# EAGLE design vca (EAGLE 6.5.0)

## Sheet 1 of 2
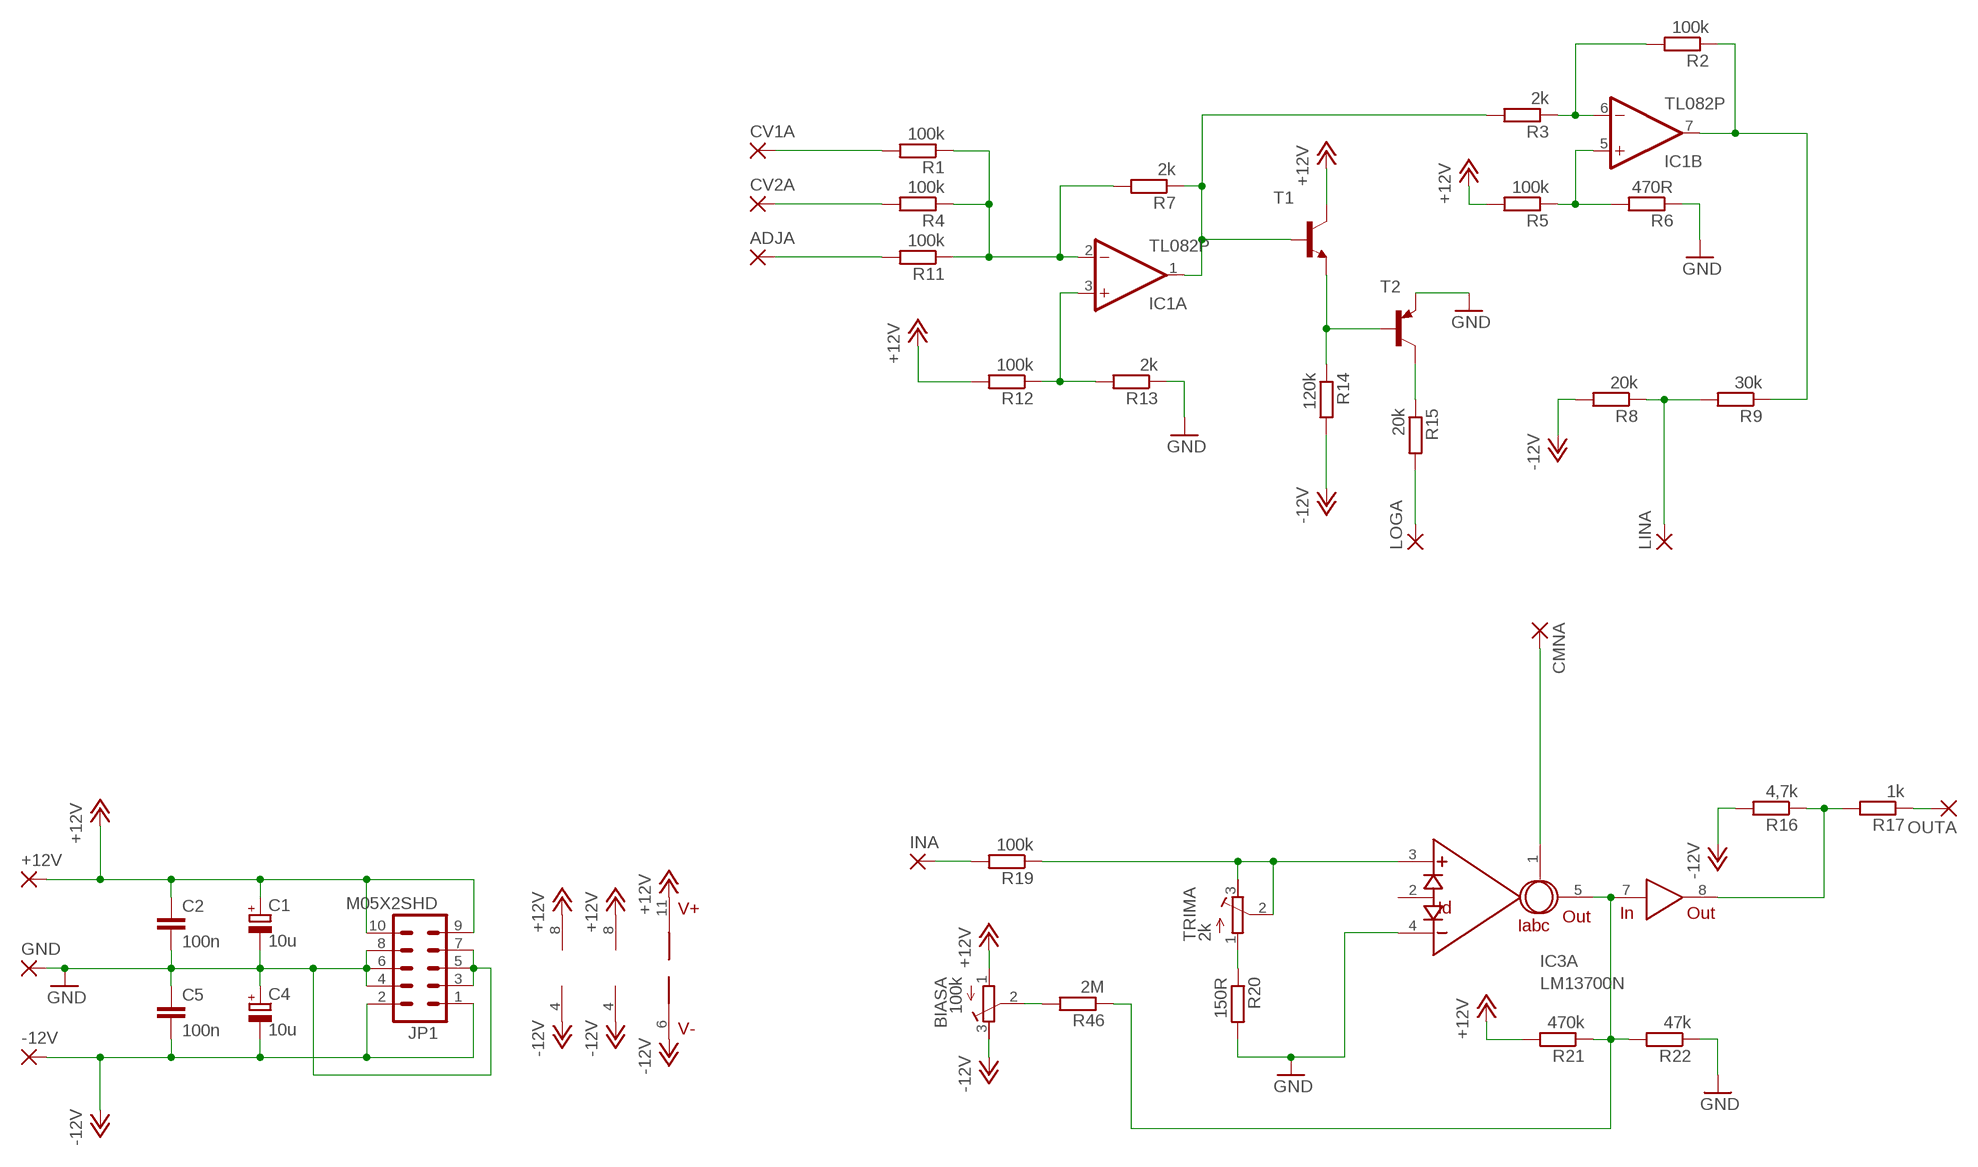
[diagram p0: schematic, sheet 1]

### Parts
+12V  2,54/1,0  [2,54/1,0]
-12V  2,54/1,0  [2,54/1,0]
ADJA  2,54/1,0  [2,54/1,0]
BIASA  100k  R-TRIMM64W  [RTRIM64W]
C1  10u  CPOL-EUE3.5-8  [E3,5-8]
C2  100n  C-EU050-035X075  [C050-035X075]
C4  10u  CPOL-EUE3.5-8  [E3,5-8]
C5  100n  C-EU050-035X075  [C050-035X075]
CMNA  2,54/1,0  [2,54/1,0]
CV1A  2,54/1,0  [2,54/1,0]
CV2A  2,54/1,0  [2,54/1,0]
GND  2,54/1,0  [2,54/1,0]
IC1  TL082P  [DIL08]
IC2  TL082P  [DIL08]
IC3  LM13700N  [DIL16]
INA  2,54/1,0  [2,54/1,0]
JP1  M05X2SHD  [2X5-SHROUDED]
LINA  2,54/1,0  [2,54/1,0]
LOGA  2,54/1,0  [2,54/1,0]
OUTA  2,54/1,0  [2,54/1,0]
R1  100k  R-EU_0309/V  [0309V]
R2  100k  R-EU_0309/10  [0309/10]
R3  2k  R-EU_0309/10  [0309/10]
R4  100k  R-EU_0309/V  [0309V]
R5  100k  R-EU_0309/10  [0309/10]
R6  470R  R-EU_0309/10  [0309/10]
R7  2k  R-EU_0309/V  [0309V]
R8  20k  R-EU_0309/10  [0309/10]
R9  30k  R-EU_0309/V  [0309V]
R11  100k  R-EU_0309/V  [0309V]
R12  100k  R-EU_0309/10  [0309/10]
R13  2k  R-EU_0309/10  [0309/10]
R14  120k  R-EU_0309/10  [0309/10]
R15  20k  R-EU_0309/V  [0309V]
R16  4,7k  R-EU_0309/10  [0309/10]
R17  1k  R-EU_0309/10  [0309/10]
R19  100k  R-EU_0309/10  [0309/10]
R20  150R  R-EU_0309/10  [0309/10]
R21  470k  R-EU_0309/10  [0309/10]
R22  47k  R-EU_0309/10  [0309/10]
R46  2M  R-EU_0309/10  [0309/10]
T1  2N3904-NPN-TO92-EBC  [TO92-EBC]
T2  2N3906-PNP-TO92-EBC  [TO92-EBC]
TRIMA  2k  R-TRIMM64W  [RTRIM64W]

### Nets
+12V: +12V.1(P) BIASA.1(A) C1.+ C2.1 IC1.8(P:V+) IC2.8(P:V+) IC3.11(V+) JP1.9 JP1.10 R5.2 R12.2 R21.2 T1.C ; also sheet 2
-12V: -12V.1(P) BIASA.3(E) C4.- C5.2 IC1.4(P:V-) IC2.4(P:V-) IC3.6(V-) JP1.1 JP1.2 R8.2 R14.2 R16.2 ; also sheet 2
GND: C1.- C2.2 C4.+ C5.1 GND.1(P) IC3.4(A:-IN) JP1.3 JP1.4 JP1.5 JP1.6 JP1.7 JP1.8 R6.1 R13.1 R20.2 R22.1 T2.E ; also sheet 2
N$1: CV1A.1(P) R1.2
N$2: CV2A.1(P) R4.2
N$3: ADJA.1(P) R11.2
N$4: IC1.2(A:-IN) R1.1 R4.1 R7.2 R11.1
N$5: IC1.3(A:+IN) R12.1 R13.2
N$6: IC1.1(A:OUT) R3.2 R7.1 T1.B
N$7: R14.1 T1.E T2.B
N$8: R15.1 T2.C
N$9: LOGA.1(P) R15.2
N$10: IC1.6(B:-IN) R2.2 R3.1
N$11: IC1.7(B:OUT) R2.1 R9.1
N$12: IC1.5(B:+IN) R5.1 R6.2
N$13: LINA.1(P) R8.1 R9.2
N$14: IC3.5(A:OUT) IC3.7(IN) R21.1 R22.2 R46.1
N$15: INA.1(P) R19.2
N$16: CMNA.1(P) IC3.1(A:IABC)
N$17: IC3.3(A:+IN) R19.1 TRIMA.2(S) TRIMA.3(E)
N$18: R20.1 TRIMA.1(A)
N$19: OUTA.1(P) R17.1
N$20: BIASA.2(S) R46.2
N$21: IC3.8(OUT) R16.1 R17.2
Unconnected: IC3.2(A:ID)

## Sheet 2 of 2
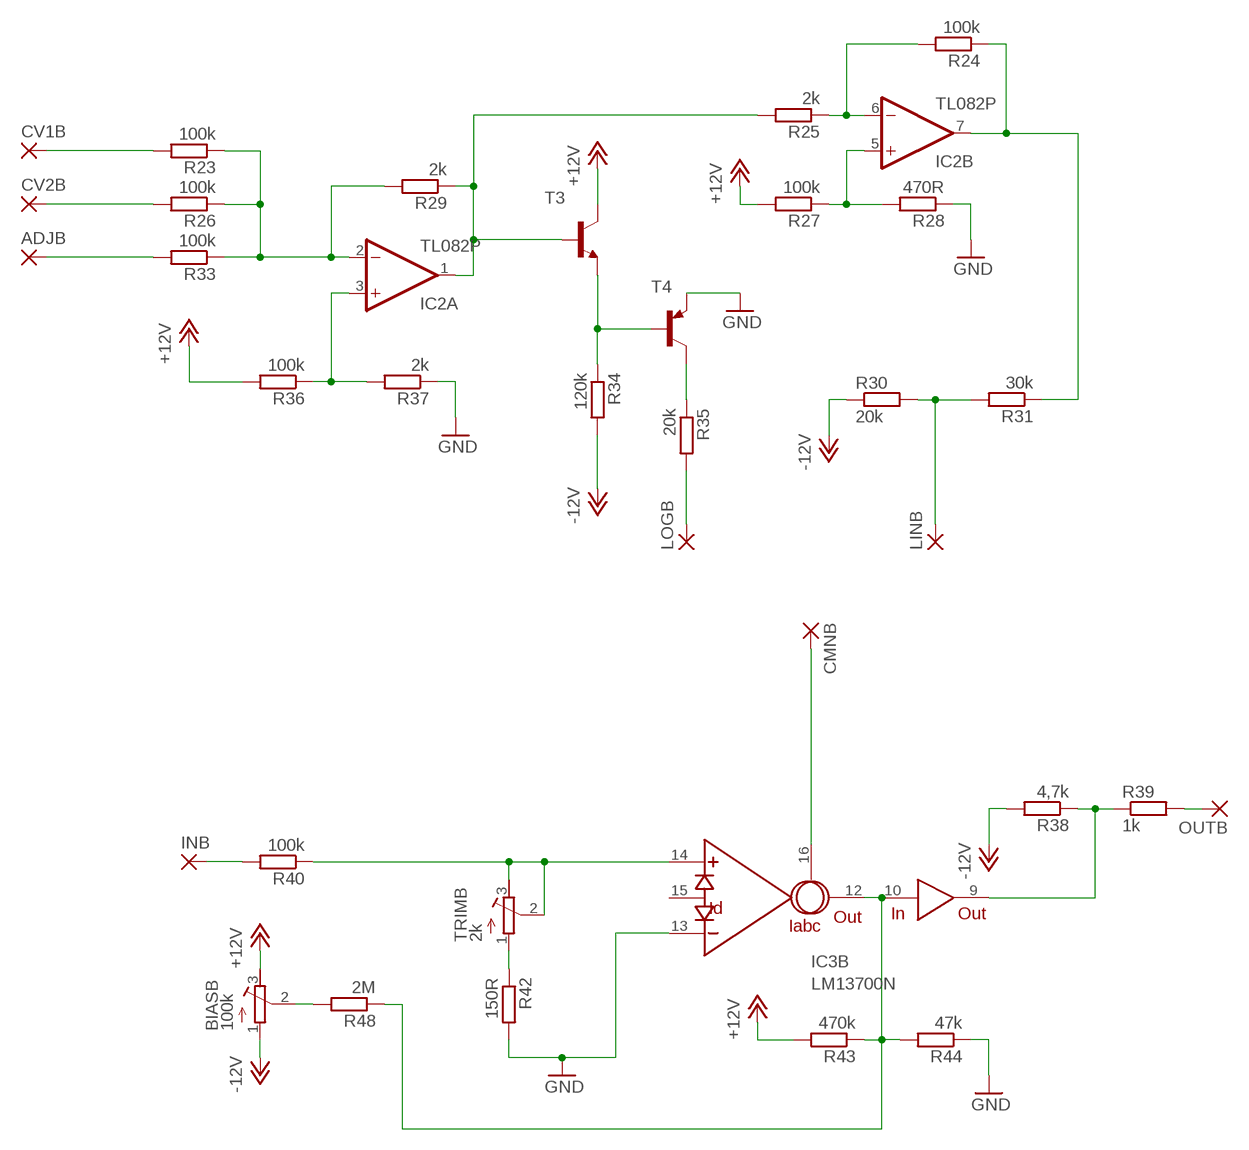
[diagram p1: schematic, sheet 2]

### Parts
ADJB  2,54/1,0  [2,54/1,0]
BIASB  100k  R-TRIMM64W  [RTRIM64W]
CMNB  2,54/1,0  [2,54/1,0]
CV1B  2,54/1,0  [2,54/1,0]
CV2B  2,54/1,0  [2,54/1,0]
INB  2,54/1,0  [2,54/1,0]
LINB  2,54/1,0  [2,54/1,0]
LOGB  2,54/1,0  [2,54/1,0]
OUTB  2,54/1,0  [2,54/1,0]
R23  100k  R-EU_0309/V  [0309V]
R24  100k  R-EU_0309/10  [0309/10]
R25  2k  R-EU_0309/10  [0309/10]
R26  100k  R-EU_0309/V  [0309V]
R27  100k  R-EU_0309/10  [0309/10]
R28  470R  R-EU_0309/10  [0309/10]
R29  2k  R-EU_0309/10  [0309/10]
R30  20k  R-EU_0309/V  [0309V]
R31  30k  R-EU_0309/V  [0309V]
R33  100k  R-EU_0309/V  [0309V]
R34  120k  R-EU_0309/10  [0309/10]
R35  20k  R-EU_0309/10  [0309/10]
R36  100k  R-EU_0309/10  [0309/10]
R37  2k  R-EU_0309/10  [0309/10]
R38  4,7k  R-EU_0309/10  [0309/10]
R39  1k  R-EU_0309/V  [0309V]
R40  100k  R-EU_0309/V  [0309V]
R42  150R  R-EU_0309/10  [0309/10]
R43  470k  R-EU_0309/10  [0309/10]
R44  47k  R-EU_0309/10  [0309/10]
R48  2M  R-EU_0309/10  [0309/10]
T3  2N3904-NPN-TO92-EBC  [TO92-EBC]
T4  2N3906-PNP-TO92-EBC  [TO92-EBC]
TRIMB  2k  R-TRIMM64W  [RTRIM64W]

### Nets
+12V: BIASB.3(E) R27.2 R36.2 R43.2 T3.C ; also sheet 1
-12V: BIASB.1(A) R30.1 R34.2 R38.2 ; also sheet 1
GND: IC3.13(B:-IN) R28.1 R37.1 R42.2 R44.1 T4.E ; also sheet 1
N$22: CV1B.1(P) R23.2
N$23: CV2B.1(P) R26.2
N$24: ADJB.1(P) R33.2
N$25: IC2.2(A:-IN) R23.1 R26.1 R29.2 R33.1
N$26: IC2.3(A:+IN) R36.1 R37.2
N$27: IC2.1(A:OUT) R25.2 R29.1 T3.B
N$28: R34.1 T3.E T4.B
N$29: R35.1 T4.C
N$30: LOGB.1(P) R35.2
N$31: IC2.6(B:-IN) R24.2 R25.1
N$32: IC2.7(B:OUT) R24.1 R31.1
N$33: IC2.5(B:+IN) R27.1 R28.2
N$34: LINB.1(P) R30.2 R31.2
N$35: IC3.10(IN) IC3.12(B:OUT) R43.1 R44.2 R48.1
N$36: INB.1(P) R40.2
N$37: CMNB.1(P) IC3.16(B:IABC)
N$38: IC3.14(B:+IN) R40.1 TRIMB.2(S) TRIMB.3(E)
N$39: R42.1 TRIMB.1(A)
N$40: BIASB.2(S) R48.2
N$41: OUTB.1(P) R39.2
N$42: IC3.9(OUT) R38.1 R39.1
Unconnected: IC3.15(B:ID)

## Library data of the parts
+12V -12V ADJA ADJB CMNA CMNB CV1A CV1B CV2A CV2B GND INA INB LINA LINB LOGA LOGB OUTA OUTB = wirepad:2,54/1,0: THROUGH-HOLE PAD
BIASA BIASB TRIMA TRIMB = rcl:R-TRIMM: Trimm resistor
C1 C4 = rcl:CPOL-EU: POLARIZED CAPACITOR, European symbol
C2 C5 = rcl:C-EU: CAPACITOR, European symbol
IC1 IC2 = cavalier:TL082: OP AMP
IC3 = synthdiy:LM13700: National Dual OTA with buffers.
JP1 = SparkFun:M05X2: Header 5x2 Standard 10-pin dual row 0.1" header. Commonly used with AVR-ISP. Use with Spark Fun Electronics SKU: PRT-00778
R1-R9 R11-R17 R19-R31 R33-R40 R42-R44 R46 R48 = rcl:R-EU_: RESISTOR, European symbol
T1 T3 = transistor-neu-to92:*-NPN-: NPN Transistror
T2 T4 = transistor-neu-to92:*-PNP-: PNP Transistror

## Board
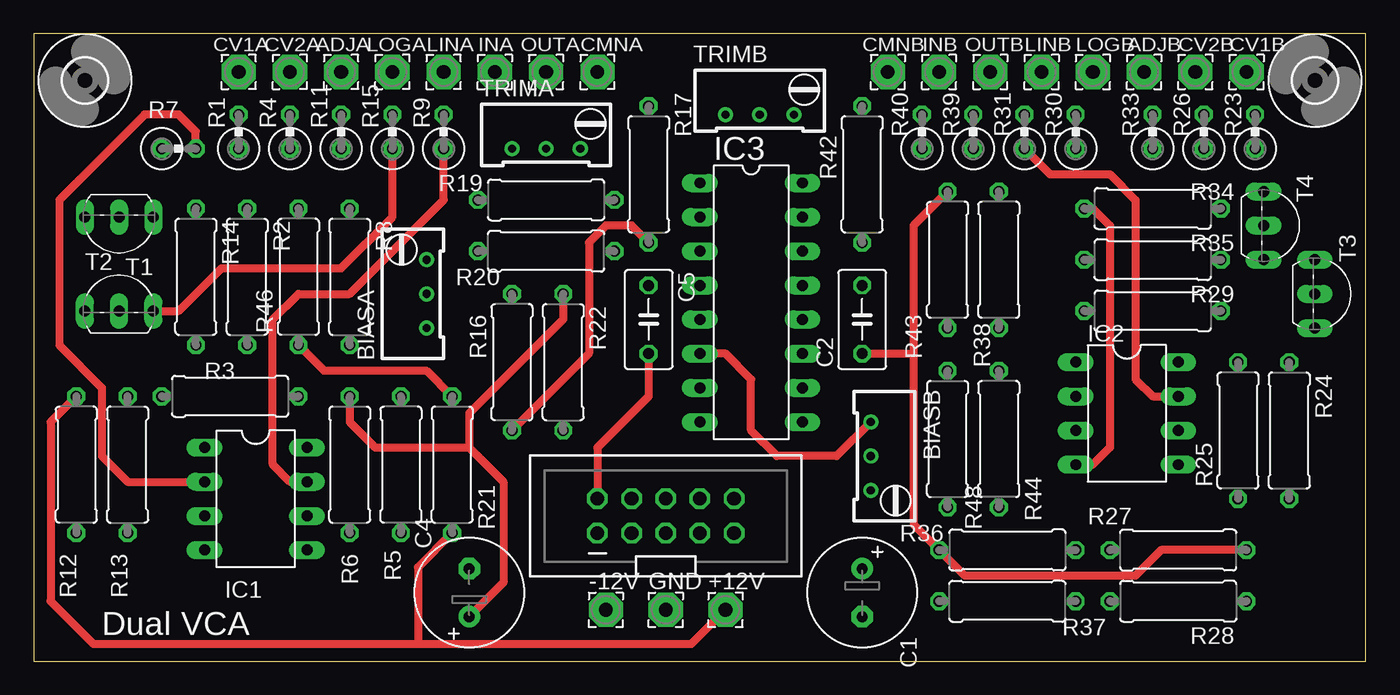
[diagram p2: board, top side]
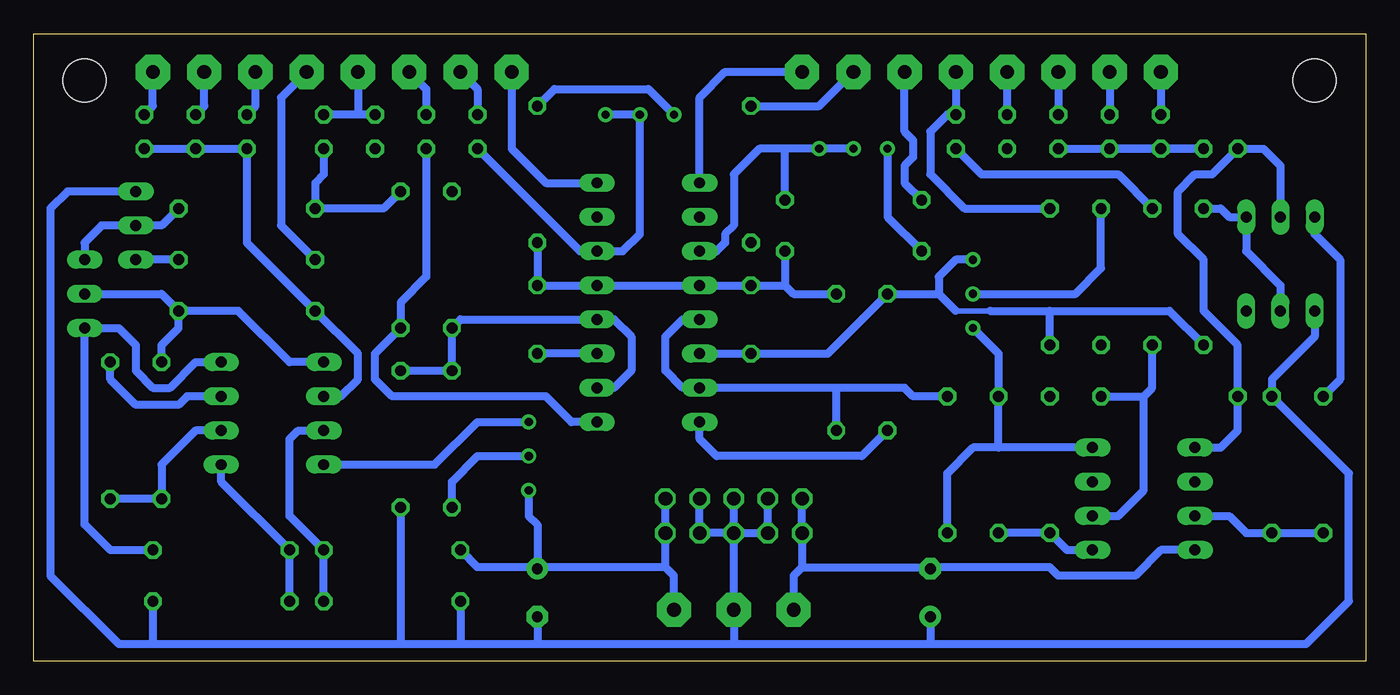
[diagram p3: board, bottom side, seen from below]

Size 99.04 x 46.66 mm. Coordinates in mm from the lower left corner, seen from the top.
Outline: 0,0 99.04,0 99.04,46.66 0,46.66 0,0
Copper layers (1*16): Top 0.035mm / dielectric 1.5mm / Bottom 0.035mm
Design rules "default": minimum track width 10mil, minimum drill 24mil, track to track 8mil, track to pad 8mil, pad to pad 8mil, via to via 8mil, smd to smd 8mil, copper to edge 40mil, drill to drill 8mil, minimum pad ring 10mil, minimum via ring 8mil, stop-mask expansion 4mil, vias tented up to drill 0mil, thermal gap 10mil

### Footprints (pad centres in the part's own frame; a part is rotated, then mirrored left to right if it is on the bottom)
2,54/1,0 = drill 1.016 pad 2.54 octagon: 1 0,0
RTRIM64W = drill 0.61: 1 1.27,-2.54; 2 1.27,0; 3 1.27,2.54
E3,5-8 = drill 0.813 pad 1.6: + -1.778,0 | drill 0.813 pad 1.6 octagon: - 1.778,0
C050-035X075 = drill 0.813 octagon: 1 -2.54,0; 2 2.54,0
DIL08 = drill 0.813 pad 1.27 long: 1 -3.81,-3.81; 2 -1.27,-3.81; 3 1.27,-3.81; 4 3.81,-3.81; 5 3.81,3.81; 6 1.27,3.81; 7 -1.27,3.81; 8 -3.81,3.81
DIL16 = drill 0.813 long: 1 -8.89,-3.81; 2 -6.35,-3.81; 3 -3.81,-3.81; 4 -1.27,-3.81; 5 1.27,-3.81; 6 3.81,-3.81; 7 6.35,-3.81; 8 8.89,-3.81; 9 8.89,3.81; 10 6.35,3.81; 11 3.81,3.81; 12 1.27,3.81; 13 -1.27,3.81; 14 -3.81,3.81; 15 -6.35,3.81; 16 -8.89,3.81
2X5-SHROUDED = drill 1.016 octagon: 1 -1.27,5.08; 2 1.27,5.08; 3 -1.27,2.54; 4 1.27,2.54; 5 -1.27,0; 6 1.27,0; 7 -1.27,-2.54; 8 1.27,-2.54; 9 -1.27,-5.08; 10 1.27,-5.08
0309V = drill 0.813 octagon: 1 -1.27,0; 2 1.27,0
0309/10 = drill 0.813 octagon: 1 -5.08,0; 2 5.08,0
TO92-EBC = drill 0.813 long: B 0,-1.27; C 2.54,-1.27; E -2.54,-1.27
3,2 = hole 3.2: 0,0

### Placement (x,y rotation side)
+12V  51.44,3.81 0 top
-12V  42.55,3.81 0 top
ADJA  22.86,43.81 90 top
ADJB  82.55,43.81 0 top
BIASA  27.94,27.3 0 top
BIASB  63.5,15.24 180 top
C1  61.59,5.08 270 top
C2  61.59,25.4 90 top
C4  32.38,5.08 90 top
C5  45.72,25.4 270 top
CMNA  41.91,43.81 90 top
CMNB  63.5,43.81 0 top
CV1A  15.24,43.81 90 top
CV1B  90.17,43.81 0 top
CV2A  19.05,43.81 90 top
CV2B  86.36,43.81 0 top
GND  46.99,3.81 0 top
IC1  16.51,12.06 270 top
IC2  81.28,18.41 270 top
IC3  53.34,26.67 270 top
INA  34.29,43.81 0 top
INB  67.31,43.81 0 top
JP1  46.99,10.79 90 top
LINA  30.48,43.81 90 top
LINB  74.93,43.81 0 top
LOGA  26.67,43.81 90 top
LOGB  78.74,43.81 0 top
OUTA  38.1,43.81 0 top
OUTB  71.12,43.81 0 top
R1  15.24,39.37 90 top
R2  15.88,28.57 270 top
R3  14.61,19.68 180 top
R4  19.05,39.37 90 top
R5  27.3,14.61 90 top
R6  23.5,14.61 270 top
R7  10.79,38.1 0 top
R8  23.5,28.57 270 top
R9  30.48,39.37 90 top
R11  22.86,39.37 90 top
R12  3.17,14.61 90 top
R13  6.99,14.61 270 top
R14  12.06,28.57 270 top
R15  26.67,39.37 90 top
R16  35.56,22.23 90 top
R17  45.72,36.2 270 top
R19  38.1,34.29 180 top
R20  38.1,30.48 0 top
R21  31.11,14.61 270 top
R22  39.37,22.23 270 top
R23  90.81,39.37 90 top
R24  93.34,17.14 270 top
R25  89.53,17.14 90 top
R26  87,39.37 90 top
R27  85.09,8.26 0 top
R28  85.09,4.45 180 top
R29  83.19,26.04 180 top
R30  77.47,39.37 90 top
R31  73.66,39.37 90 top
R33  83.19,39.37 90 top
R34  83.19,33.66 180 top
R35  83.19,29.84 180 top
R36  72.39,8.26 180 top
R37  72.39,4.45 0 top
R38  71.75,29.84 90 top
R39  69.85,39.37 90 top
R40  66.04,39.37 90 top
R42  61.59,36.2 270 top
R43  67.94,29.84 90 top
R44  71.75,16.51 90 top
R46  19.68,28.57 90 top
R48  67.94,16.51 270 top
T1  6.35,31.75 180 top
T2  6.35,27.3 0 top
T3  96.52,27.3 270 top
T4  92.71,32.38 270 top
TRIMA  38.1,39.37 270 top
TRIMB  53.98,41.91 270 top
U$1  [3,2]  95.25,43.18 90 top
U$2  [3,2]  3.81,43.18 0 top

### Tracks (layer width: path | path; a pad name or v marks a point on that pad's centre or on a via)
+12V
  Top 0.61: R43.2 65.41,32.38 65.41,22.86 | 65.41,22.86 65.41,10.16 R36.2 69.22,6.35 81.92,6.35 83.82,8.26 R27.2 | C2.1 65.41,22.86 | R21.2 28.57,6.99 28.57,1.27 | 28.57,1.27 48.9,1.27 +12V.1 | R12.2 1.27,17.78 1.27,4.45 4.45,1.27 28.57,1.27
  Bottom 0.61: IC3.11 C2.1 | T1.C 3.81,31.75 1.91,29.84 1.91,20.95 R12.2 | +12V.1 51.44,6.35 52.07,6.99 | 52.07,6.99 JP1.9 JP1.10 | R36.2 66.04,6.99 61.59,6.99 | BIASB.3 62.23,10.79 61.59,10.16 61.59,6.99 | 27.3,15.88 R5.2 27.3,22.86 BIASA.1 | IC1.8 27.3,15.88 | 27.3,15.88 29.21,15.88 31.11,13.97 R21.2 | 52.07,6.99 61.47,6.99 C1.+ 61.59,6.99 | IC2.8 87,22.23 88.9,20.32 90.17,20.32 91.44,21.59 91.44,23.5 92.71,24.77 T3.C 95.25,10.16 93.34,8.26 R27.2
-12V
  Top 0.61: R34.2 78.74,33.66 80.01,32.38 80.01,15.88 78.74,14.61 IC2.4 | BIASB.1 59.69,15.24 55.24,15.24 53.34,17.14 53.34,20.95 51.44,22.86 IC3.6 | C5.2 45.72,19.68 41.91,15.88 JP1.2
  Bottom 0.406: 30.48,26.04 27.94,26.04
  Bottom 0.61: R30.1 77.47,36.2 78.11,35.56 R34.2 73.03,33.66 R38.2 | JP1.2 JP1.1 41.91,6.99 | IC2.4 69.22,14.61 66.04,17.78 BIASB.1 | IC1.4 15.24,8.26 17.14,6.35 22.86,6.35 23.5,6.99 32.26,6.99 C4.- 32.51,6.99 41.91,6.99 | 31.75,27.3 R16.2 40.01,22.86 C5.2 IC3.6 | BIASA.3 30.48,29.84 31.75,28.57 31.75,27.3 | 31.75,27.3 30.48,26.04 | R8.2 23.5,26.04 | R14.2 14.61,26.04 23.5,26.04 | 27.94,26.04 23.5,26.04 | 41.91,6.99 42.55,6.35 -12V.1
GND
  Top 0.61: R6.1 23.5,17.78 25.4,15.88 32.38,15.88 | C4.+ 34.92,5.84 34.92,13.34 32.38,15.88 | R22.1 39.37,25.4 32.38,18.41 32.38,15.88
  Bottom 0.61: R42.2 C2.2 IC3.13 IC3.4 C5.1 43.18,27.94 | 90.17,1.27 92.71,1.27 97.79,6.35 97.79,33.66 96.52,34.92 T4.E | 90.17,1.27 71.75,1.27 | 71.75,1.27 67.31,1.27 | 67.31,1.27 61.59,1.27 | 61.59,1.27 46.99,1.27 | 46.99,1.27 32.38,1.27 | 32.38,1.27 4.45,1.27 1.27,4.45 1.27,13.97 R13.1 6.99,20.95 3.81,24.13 T2.E | R44.1 71.75,1.27 | R37.1 67.31,1.27 | C1.- 61.59,1.27 | 46.99,1.27 GND.1 JP1.5 | JP1.5 JP1.7 JP1.8 | JP1.5 JP1.3 JP1.4 | C4.+ 32.38,1.27 | JP1.5 JP1.6 | 43.18,27.94 42.55,27.3 R22.1 | R20.2 43.18,27.94 | R28.1 90.17,1.27
N$1
  Bottom 0.61: CV1A.1 R1.2
N$2
  Bottom 0.61: CV2A.1 R4.2
N$3
  Bottom 0.61: ADJA.1 R11.2
N$4
  Top 0.61: R7.2 12.06,39.37 10.79,40.64 8.26,40.64 1.91,34.29 1.91,23.5 5.08,20.32 5.08,15.24 6.99,13.34 IC1.2
  Bottom 0.61: R11.1 R4.1 | R4.1 R1.1 R7.2 R4.1
N$5
  Bottom 0.61: IC1.3 10.16,10.79 8.89,9.53 R13.2 R12.1
N$6
  Bottom 0.61: T1.B 6.35,36.83 7.62,38.1 R7.1 11.43,36.2 12.7,36.2 13.97,34.92 13.97,31.75 12.06,29.84 12.06,26.04 9.53,23.5 R3.2 9.53,17.14 10.79,15.88 IC1.1
N$7
  Bottom 0.61: R14.1 10.79,33.66 10.16,33.02 T1.E 8.89,30.48 6.35,27.94 T2.B
N$8
  Top 0.61: R15.1 26.67,33.02 22.86,29.21 13.97,29.21 10.79,26.04 T2.C
N$9
  Bottom 0.61: LOGA.1 R15.2
N$10
  Bottom 0.61: IC1.6 18.41,10.79 16.51,12.7 16.51,19.68 | 16.51,19.68 15.88,20.32 R2.2 | R3.1 16.51,19.68
N$11
  Top 0.61: IC1.7 19.05,13.34 17.78,14.61 17.78,25.4 19.68,27.3 23.5,27.3 30.48,34.29 R9.1
  Bottom 0.61: R9.1 28.57,36.2 18.41,36.2 R2.1
N$12
  Bottom 0.61: IC1.5 22.23,8.26 R6.2 R5.1
N$13
  Bottom 0.61: LINA.1 R9.2 31.11,40.64 32.38,39.37 32.38,36.2 29.84,33.66 R8.1
N$14
  Top 0.61: R46.1 21.59,21.59 29.21,21.59 R21.1
  Bottom 0.61: R21.1 33.66,19.68 34.29,20.32 39.37,20.32 | 39.37,20.32 IC3.7 50.8,20.32 52.07,21.59 52.07,24.13 50.8,25.4 IC3.5 | R22.2 39.37,20.32
N$15
  Bottom 0.61: INA.1 34.29,39.37 33.66,38.73 33.66,37.47 34.29,36.83 34.29,35.56 R19.2
N$16
  Bottom 0.61: IC3.1 49.53,41.91 47.62,43.81 CMNA.1
N$17
  Bottom 0.61: TRIMA.2 TRIMA.3 43.18,38.1 | 43.18,38.1 45.09,38.1 46.99,36.2 46.99,32.38 47.62,31.75 47.62,31.11 48.26,30.48 IC3.3 | R19.1 43.18,38.1
N$18
  Bottom 0.61: TRIMA.1 35.56,33.02 R20.1
N$19
  Bottom 0.61: R17.1 40.64,41.27 OUTA.1
N$20
  Bottom 0.61: BIASA.2 21.59,27.3 19.68,29.21 R46.2
N$21
  Top 0.61: R17.2 44.45,32.38 42.55,32.38 41.27,31.11 41.27,22.86 R16.1
  Bottom 0.61: R16.1 37.47,15.24 48.26,15.24 49.53,16.51 IC3.8
N$22
  Bottom 0.61: R23.2 90.17,41.27 CV1B.1
N$23
  Bottom 0.61: R26.2 86.36,41.27 CV2B.1
N$24
  Bottom 0.61: R33.2 82.55,41.27 ADJB.1
N$25
  Bottom 0.61: R23.1 R26.1 R33.1 83.19,31.11 R29.2 74.93,22.86 74.93,20.95 76.2,19.68 IC2.2
N$26
  Bottom 0.61: R37.2 R36.1 80.01,10.79 80.01,16.51 79.38,17.14 IC2.3
N$27
  Bottom 0.61: IC2.1 80.01,22.23 83.82,26.04 R29.1 | T3.B 89.53,27.3 R29.1 | R25.2 89.53,23.5 88.27,24.77 R29.1
N$28
  Bottom 0.61: R34.1 89.53,32.38 T4.B 93.98,32.38 95.25,31.11 T3.E
N$29
  Bottom 0.61: R35.1 T4.C
N$30
  Bottom 0.61: LOGB.1 80.64,41.91 80.64,32.38 R35.2
N$31
  Bottom 0.61: IC2.6 87,17.14 89.53,14.61 R25.1 R24.2
N$32
  Top 0.61: R31.1 75.56,36.2 80.01,36.2 81.92,34.29 81.92,20.95 83.19,19.68 IC2.7
  Bottom 0.61: R24.1 93.34,20.95 91.44,19.05 88.27,19.05 87.63,19.68 IC2.7
N$33
  Bottom 0.61: R28.2 R27.1 85.09,13.34 IC2.5
N$34
  Bottom 0.61: LINB.1 74.93,40.64 | 74.93,40.64 R30.2 | R31.2 74.93,40.64
N$35
  Bottom 0.61: R44.2 R48.1 R43.1 67.31,25.4 IC3.12 55.88,25.4 54.61,24.13 54.61,21.59 55.88,20.32 IC3.10
N$36
  Bottom 0.61: INB.1 66.04,42.55 R40.2
N$37
  Bottom 0.61: CMNB.1 63.5,38.1 60.96,35.56 IC3.16
N$38
  Bottom 0.61: TRIMB.3 TRIMB.2 53.98,31.75 55.24,30.48 IC3.14 58.42,30.48 R40.1
N$39
  Bottom 0.61: R42.1 60.33,42.55 53.34,42.55 TRIMB.1
N$40
  Bottom 0.61: R48.2 67.94,13.34 66.04,15.24 BIASB.2
N$41
  Bottom 0.61: OUTB.1 69.85,42.55 R39.2
N$42
  Bottom 0.61: R39.1 69.85,28.57 71.75,26.67 R38.1 73.66,22.86 73.66,20.95 72.39,19.68 60.96,19.68 59.05,17.78 IC3.9

### Text on the board
tPlace: Dual VCA